# Altium project Dual_Resonator_Breakout_Brd.PrjPcb
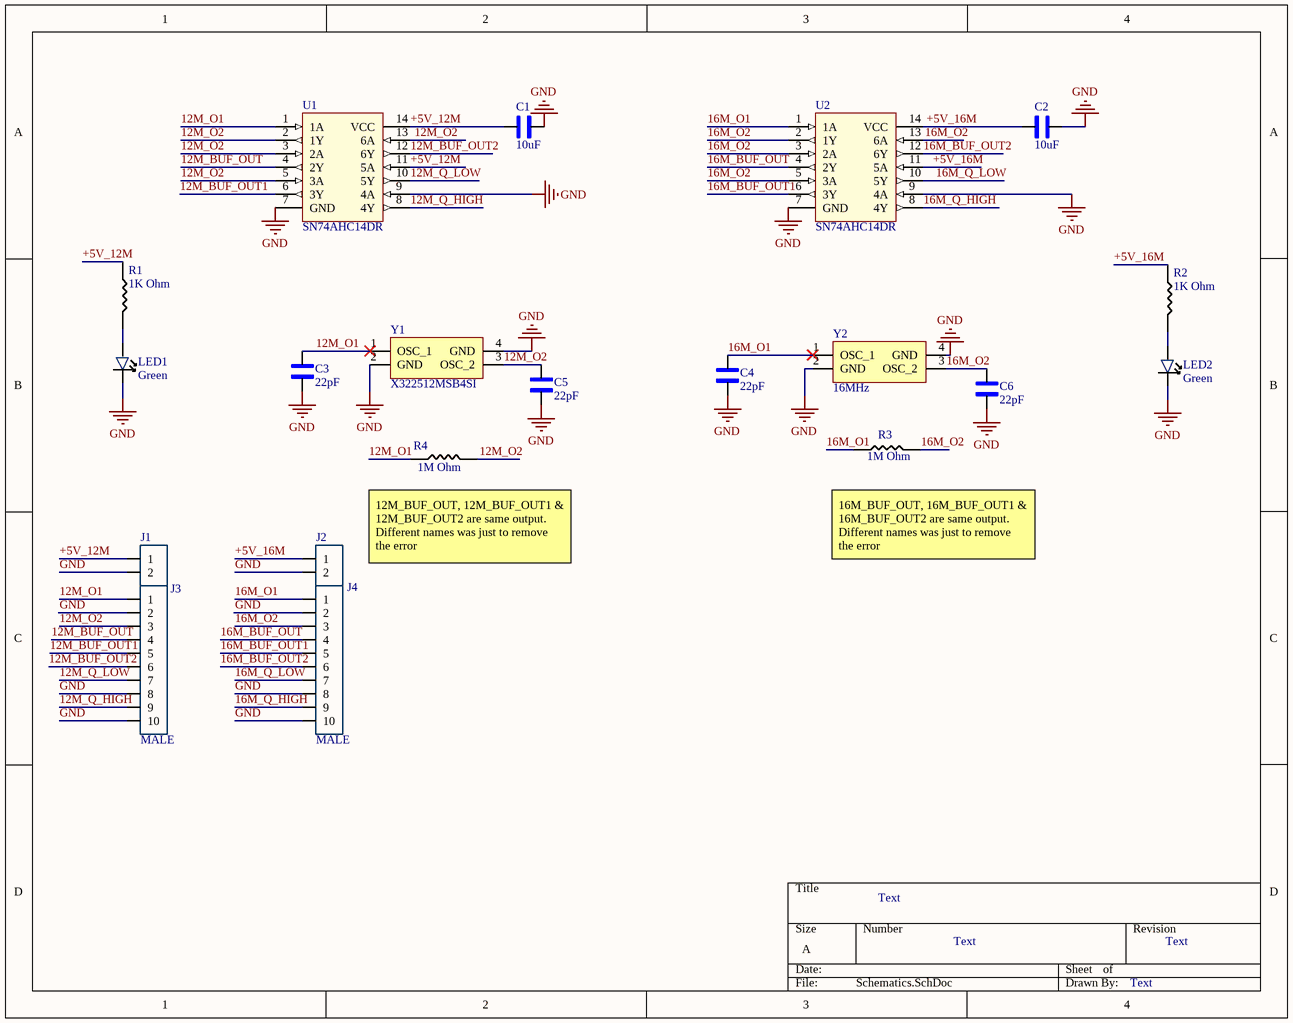
[diagram p0: Schematics.SchDoc]
1 sheet, 20 parts. Net scope: global (net labels, ports and power ports of the same name join across sheets).
Board file: Resonator_Layout.PcbDoc

## Sheet Schematics.SchDoc
size A; SheetNumber: 1; SheetTotal: 1

### Parts
C1  10uF  [0402_Passive_Capacitor]
C2  10uF  [0402_Passive_Capacitor]
C3  22pF  [0402_Passive_Capacitor]
C4  22pF  [0402_Passive_Capacitor]
C5  22pF  [0402_Passive_Capacitor]
C6  22pF  [0402_Passive_Capacitor]
J1  2 PIN  [2_PIN_100MIL]  (value not drawn)
J2  2 PIN  [2_PIN_100MIL]  (value not drawn)
J3  value MALE  [10_PIN_100MIL]  (hidden comment: MALE 10PIN)
J4  value MALE  [10_PIN_100MIL]  (hidden comment: MALE 10PIN)
LED1  value Green  [LED_0603]  (hidden comment: 0603Gr)
LED2  value Green  [LED_0603]  (hidden comment: 0603Gr)
R1  value 1K Ohm  [0402_Passive_Resistor]  (hidden comment: 1k)
R2  value 1K Ohm  [0402_Passive_Resistor]  (hidden comment: 1k)
R3  value 1M Ohm  [0402_Passive_Resistor]  (hidden comment: 1M)
R4  value 1M Ohm  [0402_Passive_Resistor]  (hidden comment: 1M)
U1  SN74AHC14DR  [SOIC127P600X175-14N]
U2  SN74AHC14DR  [SOIC127P600X175-14N]
Y1  X322512MSB4SI  [Crystal resonator]
Y2  value 16MHz  [Crystal resonator]  (hidden comment: X322516MLB4SI)

### Nets
GND: C1.2 C2.2 C3.1 C4.1 C5.1 C6.1 J1.2 J2.2 J3.2 J3.8 J3.10 J4.2 J4.8 J4.10 LED1.2 LED2.2 U1.7(GND) U1.9(4A) U2.7(GND) U2.9(4A) Y1.2(GND) Y1.4(GND) Y2.2(GND) Y2.4(GND)
12M_BUF_OUT: J3.4 U1.4(2Y)
12M_BUF_OUT1: J3.5 U1.6(3Y)
12M_BUF_OUT2: J3.6 U1.12(6Y)
12M_O1: C3.2 J3.1 R4.1 U1.1(1A) Y1.1(OSC_1)
12M_O2: C5.2 J3.3 R4.2 U1.2(1Y) U1.3(2A) U1.5(3A) U1.13(6A) Y1.3(OSC_2)
12M_Q_HIGH: J3.9 U1.8(4Y)
12M_Q_LOW: J3.7 U1.10(5Y)
16M_BUF_OUT: J4.4 U2.4(2Y)
16M_BUF_OUT1: J4.5 U2.6(3Y)
16M_BUF_OUT2: J4.6 U2.12(6Y)
16M_O1: C4.2 J4.1 R3.1 U2.1(1A) Y2.1(OSC_1)
16M_O2: C6.2 J4.3 R3.2 U2.2(1Y) U2.3(2A) U2.5(3A) U2.13(6A) Y2.3(OSC_2)
16M_Q_HIGH: J4.9 U2.8(4Y)
16M_Q_LOW: J4.7 U2.10(5Y)
+5V_12M: C1.1 J1.1 R1.1 U1.11(5A) U1.14(VCC)
+5V_16M: C2.1 J2.1 R2.1 U2.11(5A) U2.14(VCC)
NetLED1_1: LED1.1 R1.2
NetLED2_1: LED2.1 R2.2

### Notes on the sheet
- (near R4) 12M_BUF_OUT, 12M_BUF_OUT1 & 12M_BUF_OUT2 are same output. Different names was just to remove the error
- (near R3) 16M_BUF_OUT, 16M_BUF_OUT1 & 16M_BUF_OUT2 are same output. Different names was just to remove the error
- Text

### Library data of the parts
C1 C2 = C_10uF_0402: 10uF ±20% 6.3V X5R 0402 Multilayer Ceramic Capacitors MLCC - SMD/SMT RoHS; MFR Part #: CL05A106MQ5NUNC; Type: Basic; LCSC Part#: C15525; Datasheet: https://datasheet.lcsc.com/lcsc/1810191215_Samsung-Electro-Mechanics-CL05A106MQ5NUNC_C15525.pdf; Value: 10uF
C3-C6 = C_22pF_0402: MULTILAYER CERAMIC CAPACITORS MLCC - SMD/SMT 22PF 50V 0402 ROHS; MFR Part #: 0402CG220J500NT; Type: Basic; Datasheet: https://datasheet.lcsc.com/szlcsc/Guangdong-Fenghua-Advanced-Tech-0402CG220J500NT_C1555.pdf; LCSC Part#: C1555; Value: 22pF
J1 J2 = J_2_PIN_HEADER: 2.54mm Straight 2 1 Header，Breakaway Through Hole,P=2.54mm Pin Header & Female Header ROHS; MFR Part #: B-2100S02P-A110; Type: Extended; Datasheet: https://datasheet.lcsc.com/lcsc/1811151421_Ckmtw-Shenzhen-Cankemeng-B-2100S02P-A110_C124375.pdf; LCSC Part#: C124375; Value: 2 PIN
J3 J4 = JF_10_PIN_MALE: Pin Header 10 1 right-angle，180degrees 2.54mm Through Hole,P=2.54mm Pin Header & Female Header RoHS; LCSC Part#: C124372; Type: Extended; Datasheet: https://datasheet.lcsc.com/szlcsc/1810241611_Ckmtw-Shenzhen-Cankemeng-C124372_C124372.pdf
LED1 LED2 = LED_GREEN_0603: LIGHT EMITTING DIODES (LED) GREEN 520~535NM 112~258MCD@20MA TOP VIEW 0603 ROHS; MFR Part #: 19-217/GHC-YR1S2/3T; Type: Basic; LCSC Part#: C72043
R1 R2 = R_1K_0402: 1 kOhms chip resistor SURFACE MOUNT 1KOHMS ±1% 1/16W 0402 ROHS; MFR Part #: 0402WGF1001TCE; Datasheet: https://datasheet.lcsc.com/szlcsc/Uniroyal-Elec-0402WGF1001TCE_C11702.pdf; LCSC Part#: C11702; Type: Basic
R3 R4 = R_1M_0402: CHIP RESISTOR - SURFACE MOUNT 1MOHMS ±1% 1/16W 0402 ROHS; MFR Part #: 0402WGF1004TCE; Datasheet: https://datasheet.lcsc.com/szlcsc/Uniroyal-Elec-0402WGF1004TCE_C26083.pdf; LCSC Part#: C26083; Type: Basic
U1 U2 = SN74AHC14DR: 6-ch, 2-V to 5.5-V inverters with Schmitt-Trigger inputs; MF: Texas Instruments; Package: SOIC-14 Texas Instruments; Check_prices: https://www.snapeda.com/parts/SN74AHC14DR/Texas+Instruments/view-part/?ref=eda; Purchase-URL: https://pricing.snapeda.com/search/part/SN74AHC14DR/?ref=eda; Price: None; MP: SN74AHC14DR; Value: *; Availability: In Stock; SnapEDA_Link: https://www.snapeda.com/parts/SN74AHC14DR/Texas+Instruments/view-part/?ref=snap; Parameter 1: *
Y1 = X_12MHz_Res: SMD Crystal Resonators 12MHz ±10ppm SMD-3225_4P RoHS; LCSC Part#: C9002; MFR Part #: X322512MSB4SI; Value: 12MHz; Type: Basic; Datasheet: https://datasheet.lcsc.com/szlcsc/Yangxing-Tech-X322512MSB4SI_C9002.pdf
Y2 = X_16Mhz_Res: ±10ppm 16000000Hz -40℃~85℃ 贴片无源晶振 60Ω 9pF SMD3225-4P Crystals ROHS; LCSC Part#: C13738; MFR Part #: X322516MLB4SI; Type: Basic